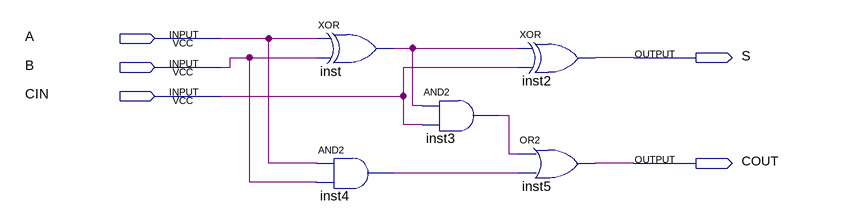
[diagram p0: schematic sheet]
// Quartus schematic FA.bdf as structural Verilog: 5 symbols, 5 pins
module FA (
  input  A,
  input  B,
  input  CIN,
  output S,
  output COUT
);

  wire inst3_out, inst4_out, inst_out;

  xor inst (inst_out, A, B);
  and inst4 (inst4_out, A, B);
  and inst3 (inst3_out, inst_out, CIN);
  xor inst2 (S, inst_out, CIN);
  or inst5 (COUT, inst3_out, inst4_out);
endmodule
